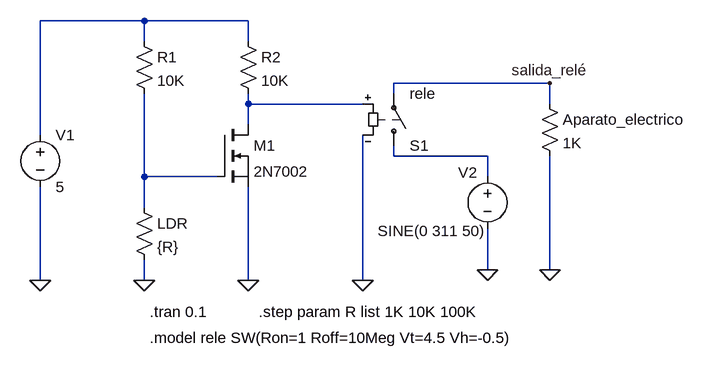
[diagram p0: schematic encendido-automatico-luz.asc]
encendido-automatico-luz.asc, the LTspice schematic file:
Version 4
SHEET 1 912 680
WIRE -32 -32 -192 -32
WIRE 128 -32 -32 -32
WIRE -32 0 -32 -32
WIRE 128 0 128 -32
WIRE 592 64 352 64
WIRE 352 80 352 64
WIRE 128 96 128 80
WIRE 304 96 128 96
WIRE 592 96 592 64
WIRE 128 128 128 96
WIRE -192 144 -192 -32
WIRE 352 176 352 160
WIRE 496 176 352 176
WIRE -32 208 -32 80
WIRE 80 208 -32 208
WIRE 496 208 496 176
WIRE -32 256 -32 208
WIRE 496 352 496 288
WIRE 592 352 592 176
WIRE -192 368 -192 224
WIRE -32 368 -32 336
WIRE 128 368 128 224
WIRE 304 368 304 144
FLAG -32 368 0
FLAG 128 368 0
FLAG -192 368 0
FLAG 592 64 salida_relé
FLAG 592 352 0
FLAG 496 352 0
FLAG 304 368 0
SYMBOL nmos 80 128 R0
SYMATTR InstName M1
SYMATTR Value 2N7002
SYMBOL res -48 -16 R0
SYMATTR InstName R1
SYMATTR Value 10K
SYMBOL res -48 240 R0
SYMATTR InstName LDR
SYMATTR Value {R}
SYMBOL voltage -192 128 R0
WINDOW 123 0 0 Left 0
WINDOW 39 0 0 Left 0
SYMATTR InstName V1
SYMATTR Value 5
SYMBOL sw 352 176 M180
SYMATTR InstName S1
SYMATTR Value rele
SYMBOL res 112 -16 R0
SYMATTR InstName R2
SYMATTR Value 10K
SYMBOL voltage 496 192 R0
WINDOW 0 -45 10 Left 2
WINDOW 3 -169 100 Left 2
WINDOW 123 0 0 Left 0
WINDOW 39 0 0 Left 0
SYMATTR InstName V2
SYMATTR Value SINE(0 311 50)
SYMBOL res 576 80 R0
SYMATTR InstName Aparato_electrico
SYMATTR Value 1K
TEXT 144 416 Left 2 !.step param R list 1K 10K 100K
TEXT -24 416 Left 2 !.tran 0.1
TEXT -24 456 Left 2 !.model rele SW(Ron=1 Roff=10Meg Vt=4.5 Vh=-0.5)

The netlist it stands for:
* encendido-automatico-luz.asc
M1 N002 N004 0 0 2N7002
R1 N001 N004 10K
R§LDR N004 0 {R}
V1 N001 0 5
S1 N003 salida_relé N002 0 rele
R2 N001 N002 10K
V2 N003 0 SINE(0 311 50)
R§Aparato_electrico salida_relé 0 1K
.model NMOS NMOS
.model PMOS PMOS
.lib standard.mos
.step param R list 1K 10K 100K
.tran 0.1
.model rele SW(Ron=1 Roff=10Meg Vt=4.5 Vh=-0.5)
.backanno
.end